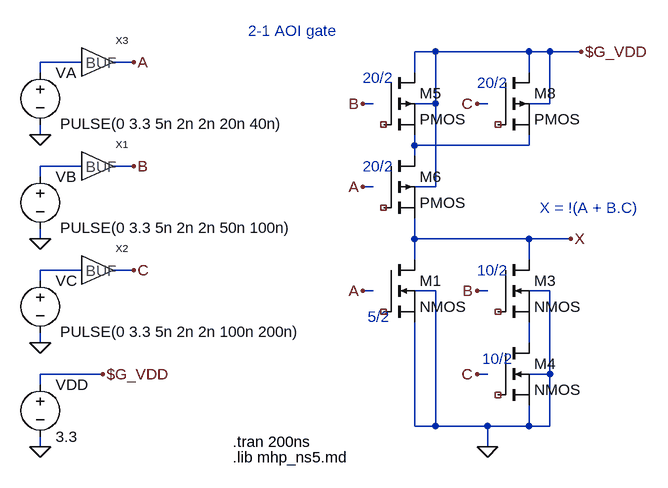
[diagram p0: schematic 21aoi_tb.asc]
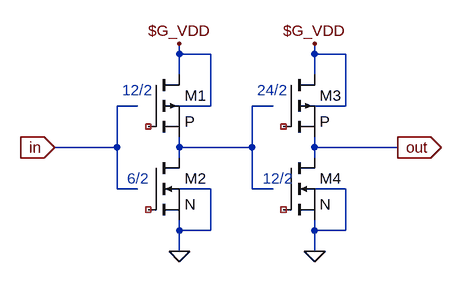
[diagram p1: sub-circuit buf.asc]
21aoi_tb.asc, the LTspice schematic file:
Version 4
SHEET 1 880 868
WIRE -128 -240 -160 -240
WIRE 16 -240 -128 -240
WIRE 48 -240 16 -240
WIRE 96 -240 48 -240
WIRE -672 -224 -736 -224
WIRE -592 -224 -624 -224
WIRE -736 -208 -736 -224
WIRE -160 -208 -160 -240
WIRE 16 -208 16 -240
WIRE -224 -160 -240 -160
WIRE -128 -160 -128 -240
WIRE -128 -160 -160 -160
WIRE -48 -160 -64 -160
WIRE 48 -160 48 -240
WIRE 48 -160 16 -160
WIRE -736 -112 -736 -128
WIRE -160 -96 -160 -112
WIRE 16 -96 16 -112
WIRE 16 -96 -160 -96
WIRE -160 -80 -160 -96
WIRE -672 -64 -736 -64
WIRE -592 -64 -624 -64
WIRE -736 -48 -736 -64
WIRE -224 -32 -240 -32
WIRE -128 -32 -128 -160
WIRE -128 -32 -160 -32
WIRE -736 48 -736 32
WIRE -160 48 -160 16
WIRE 16 48 -160 48
WIRE 80 48 16 48
WIRE -160 80 -160 48
WIRE 16 80 16 48
WIRE -672 96 -736 96
WIRE -592 96 -624 96
WIRE -736 112 -736 96
WIRE -224 128 -240 128
WIRE -128 128 -160 128
WIRE -48 128 -64 128
WIRE 48 128 16 128
WIRE -736 208 -736 192
WIRE 16 208 16 176
WIRE -640 256 -736 256
WIRE -48 256 -64 256
WIRE 48 256 48 128
WIRE 48 256 16 256
WIRE -736 272 -736 256
WIRE -160 336 -160 176
WIRE -128 336 -128 128
WIRE -128 336 -160 336
WIRE -48 336 -128 336
WIRE 16 336 16 304
WIRE 16 336 -48 336
WIRE 48 336 48 256
WIRE 48 336 16 336
WIRE -736 368 -736 352
WIRE -48 368 -48 336
FLAG 80 48 X
FLAG -48 368 0
FLAG 96 -240 $G_VDD
FLAG -736 368 0
FLAG -640 256 $G_VDD
FLAG -240 128 A
FLAG -240 -32 A
FLAG -240 -160 B
FLAG -64 128 B
FLAG -64 -160 C
FLAG -64 256 C
FLAG -736 -112 0
FLAG -592 -224 A
FLAG -736 48 0
FLAG -592 -64 B
FLAG -736 208 0
FLAG -592 96 C
SYMBOL voltage -736 -224 R0
WINDOW 3 31 95 Left 2
WINDOW 123 0 0 Left 2
WINDOW 39 0 0 Left 2
SYMATTR Value PULSE(0 3.3 5n 2n 2n 20n 40n)
SYMATTR InstName VA
SYMBOL voltage -736 256 R0
WINDOW 123 0 0 Left 2
WINDOW 39 0 0 Left 2
SYMATTR InstName VDD
SYMATTR Value 3.3
SYMBOL voltage -736 -64 R0
WINDOW 3 31 95 Left 2
WINDOW 123 0 0 Left 2
WINDOW 39 0 0 Left 2
SYMATTR Value PULSE(0 3.3 5n 2n 2n 50n 100n)
SYMATTR InstName VB
SYMBOL nmos -208 80 R0
SYMATTR InstName M1
SYMATTR Value2 l=0.6u w=1.5u
SYMATTR SpiceModel ""
SYMATTR Value NMOS
SYMBOL nmos -32 80 R0
SYMATTR InstName M3
SYMATTR Value2 l=0.6u w=3u
SYMATTR SpiceModel ""
SYMATTR Value NMOS
SYMBOL nmos -32 208 R0
SYMATTR InstName M4
SYMATTR Value2 l=0.6u w=3u
SYMATTR SpiceModel ""
SYMATTR Value NMOS
SYMBOL pmos -208 -208 R0
SYMATTR InstName M5
SYMATTR Value2 l=0.6u w=6u
SYMATTR SpiceModel ""
SYMATTR Value PMOS
SYMBOL pmos -208 -80 R0
SYMATTR InstName M6
SYMATTR Value2 l=0.6u w=6u
SYMATTR SpiceModel ""
SYMATTR Value PMOS
SYMBOL pmos -32 -208 R0
SYMATTR InstName M8
SYMATTR Value2 l=0.6u w=6u
SYMATTR SpiceModel ""
SYMATTR Value PMOS
SYMBOL voltage -736 96 R0
WINDOW 3 31 95 Left 2
WINDOW 123 0 0 Left 2
WINDOW 39 0 0 Left 2
SYMATTR Value PULSE(0 3.3 5n 2n 2n 100n 200n)
SYMATTR InstName VC
SYMBOL buf -656 -224 R0
SYMATTR InstName X3
SYMBOL buf -656 -64 R0
SYMATTR InstName X1
SYMBOL buf -656 96 R0
SYMATTR InstName X2
TEXT -440 360 Left 2 !.tran 200ns
TEXT -440 384 Left 2 !.lib mhp_ns5.md
TEXT 32 0 Left 2 ;X = !(A + B.C)
TEXT -416 -272 Left 2 ;2-1 AOI gate
TEXT -232 168 Left 2 ;5/2
TEXT -64 -192 Left 2 ;20/2
TEXT -240 -200 Left 2 ;20/2
TEXT -240 -64 Left 2 ;20/2
TEXT -64 96 Left 2 ;10/2
TEXT -56 232 Left 2 ;10/2

buf.asc, the sub-circuit schematic file:
Version 4
SHEET 1 1292 836
WIRE -624 -80 -624 -96
WIRE -576 -80 -624 -80
WIRE -416 -80 -416 -96
WIRE -368 -80 -416 -80
WIRE -624 -48 -624 -80
WIRE -416 -48 -416 -80
WIRE -688 0 -720 0
WIRE -576 0 -576 -80
WIRE -576 0 -624 0
WIRE -480 0 -512 0
WIRE -368 0 -368 -80
WIRE -368 0 -416 0
WIRE -720 64 -720 0
WIRE -720 64 -816 64
WIRE -624 64 -624 48
WIRE -512 64 -512 0
WIRE -512 64 -624 64
WIRE -416 64 -416 48
WIRE -288 64 -416 64
WIRE -624 80 -624 64
WIRE -416 80 -416 64
WIRE -720 128 -720 64
WIRE -688 128 -720 128
WIRE -576 128 -624 128
WIRE -512 128 -512 64
WIRE -480 128 -512 128
WIRE -368 128 -416 128
WIRE -624 192 -624 176
WIRE -576 192 -576 128
WIRE -576 192 -624 192
WIRE -416 192 -416 176
WIRE -368 192 -368 128
WIRE -368 192 -416 192
WIRE -624 224 -624 192
WIRE -416 224 -416 192
FLAG -624 224 0
FLAG -816 64 in
IOPIN -816 64 In
FLAG -288 64 out
IOPIN -288 64 Out
FLAG -624 -96 $G_VDD
FLAG -416 224 0
FLAG -416 -96 $G_VDD
SYMBOL pmos -672 -48 R0
SYMATTR InstName M1
SYMATTR Value2 L=0.6U W=7.2U AS=4.86P AD=13.005P PS=7.2U PD=20.7U
SYMATTR SpiceModel ""
SYMATTR Value P
SYMBOL nmos -672 80 R0
SYMATTR InstName M2
SYMATTR Value2 L=0.6U W=3.6U AS=4.86P AD=7.065P PS=7.2U PD=13.5U
SYMATTR Value N
SYMBOL pmos -464 -48 R0
SYMATTR InstName M3
SYMATTR Value2 l=0.6U w=7.2U ad=13.005P as=4.86P pd=20.7U ps=7.2U m=2
SYMATTR SpiceModel ""
SYMATTR Value P
SYMBOL nmos -464 80 R0
SYMATTR InstName M4
SYMATTR Value2 l=0.6U w=3.6U ad=7.065P as=4.86P pd=13.5U ps=7.2U m=2
SYMATTR Value N
TEXT -712 -24 Left 2 ;12/2
TEXT -704 112 Left 2 ;6/2
TEXT -504 -24 Left 2 ;24/2
TEXT -496 112 Left 2 ;12/2

The netlist it stands for:
* 21aoi_tb.asc
VA N001 0 PULSE(0 3.3 5n 2n 2n 20n 40n)
VDD $G_VDD 0 3.3
VB N003 0 PULSE(0 3.3 5n 2n 2n 50n 100n)
* M1: NMOS l=0.6u w=1.5u (symbol nmos not certain, pin order unknown); nets seen at it: 0, X
* M3: NMOS l=0.6u w=3u (symbol nmos not certain, pin order unknown); nets seen at it: N005, X
* M4: NMOS l=0.6u w=3u (symbol nmos not certain, pin order unknown); nets seen at it: 0, N005
* M5: PMOS l=0.6u w=6u (symbol pmos not certain, pin order unknown); nets seen at it: $G_VDD, N002
* M6: PMOS l=0.6u w=6u (symbol pmos not certain, pin order unknown); nets seen at it: N002, X
* M8: PMOS l=0.6u w=6u (symbol pmos not certain, pin order unknown); nets seen at it: $G_VDD, N002
VC N004 0 PULSE(0 3.3 5n 2n 2n 100n 200n)
XX3 N001 A buf
XX1 N003 B buf
XX2 N004 C buf

* block symbol definitions
.subckt buf in out
* M1: P L=0.6U W=7.2U AS=4.86P AD=13.005P PS=7.2U PD=20.7U (symbol pmos not certain, pin order unknown); nets seen at it: $G_VDD, N001
* M2: N L=0.6U W=3.6U AS=4.86P AD=7.065P PS=7.2U PD=13.5U (symbol nmos not certain, pin order unknown); nets seen at it: 0, N001
* M3: P l=0.6U w=7.2U ad=13.005P as=4.86P pd=20.7U ps=7.2U m=2 (symbol pmos not certain, pin order unknown); nets seen at it: $G_VDD, out
* M4: N l=0.6U w=3.6U ad=7.065P as=4.86P pd=13.5U ps=7.2U m=2 (symbol nmos not certain, pin order unknown); nets seen at it: 0, out
* 12/2
* 6/2
* 24/2
* 12/2
.ends buf

.tran 200ns
.lib mhp_ns5.md
* X = !(A + B.C)
* 2-1 AOI gate
* 5/2
* 20/2
* 20/2
* 20/2
* 10/2
* 10/2
.backanno
.end